# Altium schematic sheet MCU.SchDoc
size A3
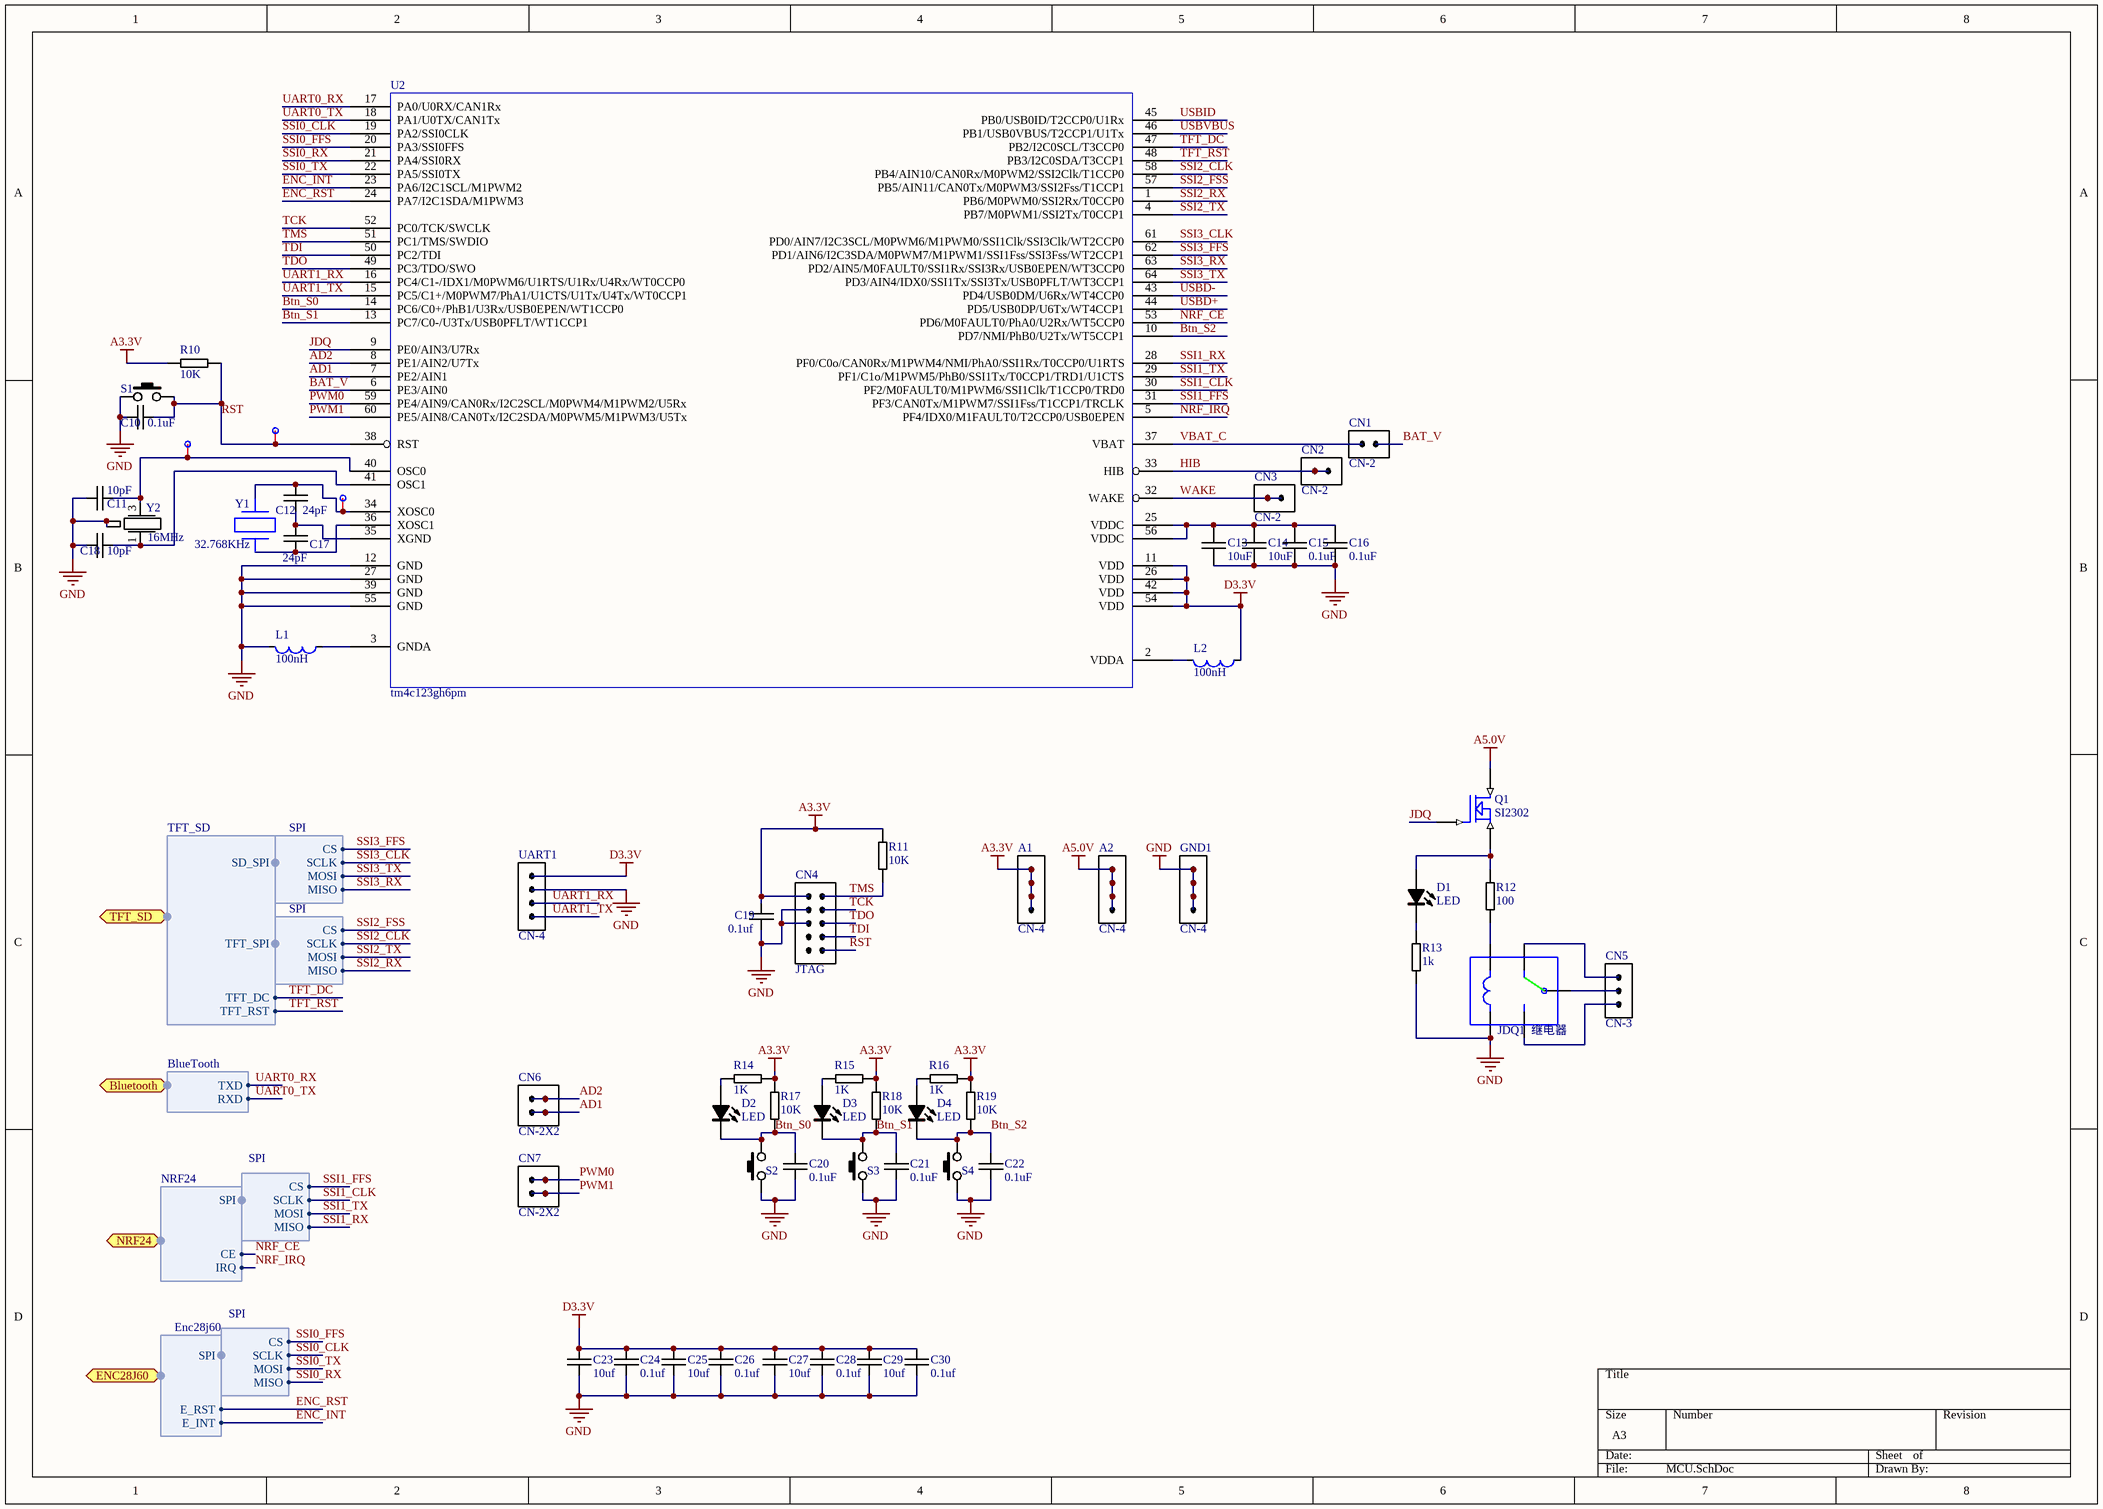
[diagram p0: MCU.SchDoc]

## Parts
*2  Point  [Point]  (value not drawn)
*3  Point  [Point]  (value not drawn)
*4  Point  [Point]  (value not drawn)
A1  CN-4  [SIP-4]
A2  CN-4  [SIP-4]
C10  0.1uF  [0805-C]
C11  10pF  [0805-C]
C12  24pF  [0805-C]
C13  10uF  [0805-C]
C14  10uF  [0805-C]
C15  0.1uF  [0805-C]
C16  0.1uF  [0805-C]
C17  24pF  [0805-C]
C18  10pF  [0805-C]
C19  0.1uf  [0805-C]
C20  0.1uF  [0805-C]
C21  0.1uF  [0805-C]
C22  0.1uF  [0805-C]
C23  10uf  [0603]
C24  0.1uf  [0603]
C25  10uf  [0603]
C26  0.1uf  [0603]
C27  10uf  [0603]
C28  0.1uf  [0603]
C29  10uf  [0603]
C30  0.1uf  [0603]
CN1  CN-2  [SIP-2]
CN2  CN-2  [SIP-2]
CN3  CN-2  [SIP-2]
CN4  JTAG  [IDC-10]
CN5  CN-3  [SIP-3]
CN6  CN-2X2  [IDC-4]
CN7  CN-2X2  [IDC-4]
D1  LED  [0805-LED]
D2  LED  [0805-LED]
D3  LED  [0805-LED]
D4  LED  [0805-LED]
GND1  CN-4  [SIP-4]
JDQ1  继电器  [继电器]
L1  100nH  [0805]
L2  100nH  [0805]
Q1  SI2302  [sot-23]
R10  10K  [0805-R]
R11  10K  [0805-R]
R12  100  [0603]
R13  1k  [0805-R]
R14  1K  [0805-R]
R15  1K  [0805-R]
R16  1K  [0805-R]
R17  10K  [0805-R]
R18  10K  [0805-R]
R19  10K  [0805-R]
S1  KEY(轻触,6×6×4.3)  [轻触开关(3*6*2.5)]  (value not drawn)
S2  KEY(轻触,6×6×4.3)  [轻触开关(3*6*2.5)]  (value not drawn)
S3  KEY(轻触,6×6×4.3)  [轻触开关(3*6*2.5)]  (value not drawn)
S4  KEY(轻触,6×6×4.3)  [轻触开关(3*6*2.5)]  (value not drawn)
U2  tm4c123gh6pm  [LQFP64]
UART1  CN-4  [SIP-4]
Y1  32.768KHz  [XTAL(Φ2×6)]
Y2  16MHz  [4脚晶振]

## Ports
Bluetooth (harness BlueTooth), ENC28J60 (harness Enc28j60), NRF24 (harness NRF24), TFT_SD (harness TFT_SD)

## Harnesses
Enc28j60: SPI, E_RST, E_INT
SPI: CS, SCLK, MOSI, MISO
NRF24: SPI, CE, IRQ
BlueTooth: TXD, RXD
TFT_SD: SD_SPI, TFT_SPI, TFT_DC, TFT_RST

## Nets
A3.3V: A1.1 A1.2 A1.3 A1.4 C19.1 CN4.1 R10.2 R11.2 R14.2 R15.2 R16.2 R17.1 R18.1 R19.1
A5.0V: A2.1 A2.2 A2.3 A2.4 Q1.3(D)
D3.3V: C23.1 C24.1 C25.1 C26.1 C27.1 C28.1 C29.1 C30.1 L2.2 U2.11(VDD) U2.26(VDD) U2.42(VDD) U2.54(VDD) UART1.1
GND: C10.1 C11.1 C13.2 C14.2 C15.2 C16.2 C18.1 C19.2 C20.1 C21.1 C22.1 C23.2 C24.2 C25.2 C26.2 C27.2 C28.2 C29.2 C30.2 CN4.3 CN4.5 GND1.1 GND1.2 GND1.3 GND1.4 JDQ1.5(I2) L1.1 R13.2 S1.1 S2.1 S3.1 S4.1 U2.12(GND) U2.27(GND) U2.39(GND) U2.55(GND) UART1.2 Y2.2(G) Y2.4(G)
AD1: CN6.3 CN6.4 U2.7(PE2/AIN1)
AD2: CN6.1 CN6.2 U2.8(PE1/AIN2/U7Tx)
BAT_V: CN1.2 U2.6(PE3/AIN0)
Btn_S0: C20.2 D2.2(K) R17.2 S2.2 U2.14(PC6/C0+/PhB1/U3Rx/USB0EPEN/WT1CCP0)
Btn_S1: C21.2 D3.2(K) R18.2 S3.2 U2.13(PC7/C0-/U3Tx/USB0PFLT/WT1CCP1)
Btn_S2: C22.2 D4.2(K) R19.2 S4.2 U2.10(PD7/NMI/PhB0/U2Tx/WT5CCP1)
ENC_INT: U2.23(PA6/I2C1SCL/M1PWM2) ; port ENC28J60.E_INT
ENC_RST: U2.24(PA7/I2C1SDA/M1PWM3) ; port ENC28J60.E_RST
HIB: CN2.1 CN2.2 U2.33(HIB)
JDQ: Q1.1(G) U2.9(PE0/AIN3/U7Rx)
NRF_CE: U2.53(PD6/M0FAULT0/PhA0/U2Rx/WT5CCP0) ; port NRF24.CE
NRF_IRQ: U2.5(PF4/IDX0/M1FAULT0/T2CCP0/USB0EPEN) ; port NRF24.IRQ
PWM0: CN7.1 CN7.2 U2.59(PE4/AIN9/CAN0Rx/I2C2SCL/M0PWM4/M1PWM2/U5Rx)
PWM1: CN7.3 CN7.4 U2.60(PE5/AIN8/CAN0Tx/I2C2SDA/M0PWM5/M1PWM3/U5Tx)
RST: *2.1(Point) C10.2 CN4.10 R10.1 S1.2 U2.38(RST)
SSI0_CLK: U2.19(PA2/SSI0CLK) ; harness SPI.SCLK
SSI0_FFS: U2.20(PA3/SSI0FFS) ; harness SPI.CS
SSI0_RX: U2.21(PA4/SSI0RX) ; harness SPI.MISO
SSI0_TX: U2.22(PA5/SSI0TX) ; harness SPI.MOSI
SSI1_CLK: U2.30(PF2/M0FAULT0/M1PWM6/SSI1Clk/T1CCP0/TRD0) ; harness SPI.SCLK
SSI1_FFS: U2.31(PF3/CAN0Tx/M1PWM7/SSI1Fss/T1CCP1/TRCLK) ; harness SPI.CS
SSI1_RX: U2.28(PF0/C0o/CAN0Rx/M1PWM4/NMI/PhA0/SSI1Rx/T0CCP0/U1RTS) ; harness SPI.MISO
SSI1_TX: U2.29(PF1/C1o/M1PWM5/PhB0/SSI1Tx/T0CCP1/TRD1/U1CTS) ; harness SPI.MOSI
SSI2_CLK: U2.58(PB4/AIN10/CAN0Rx/M0PWM2/SSI2Clk/T1CCP0) ; harness SPI.SCLK
SSI2_FSS: U2.57(PB5/AIN11/CAN0Tx/M0PWM3/SSI2Fss/T1CCP1) ; harness SPI.CS
SSI2_RX: U2.1(PB6/M0PWM0/SSI2Rx/T0CCP0) ; harness SPI.MISO
SSI2_TX: U2.4(PB7/M0PWM1/SSI2Tx/T0CCP1) ; harness SPI.MOSI
SSI3_CLK: U2.61(PD0/AIN7/I2C3SCL/M0PWM6/M1PWM0/SSI1Clk/SSI3Clk/WT2CCP0) ; harness SPI.SCLK
SSI3_FFS: U2.62(PD1/AIN6/I2C3SDA/M0PWM7/M1PWM1/SSI1Fss/SSI3Fss/WT2CCP1) ; harness SPI.CS
SSI3_RX: U2.63(PD2/AIN5/M0FAULT0/SSI1Rx/SSI3Rx/USB0EPEN/WT3CCP0) ; harness SPI.MISO
SSI3_TX: U2.64(PD3/AIN4/IDX0/SSI1Tx/SSI3Tx/USB0PFLT/WT3CCP1) ; harness SPI.MOSI
TCK: CN4.4 U2.52(PC0/TCK/SWCLK)
TDI: CN4.8 U2.50(PC2/TDI)
TDO: CN4.6 U2.49(PC3/TDO/SWO)
TFT_DC: U2.47(PB2/I2C0SCL/T3CCP0) ; port TFT_SD.TFT_DC
TFT_RST: U2.48(PB3/I2C0SDA/T3CCP1) ; port TFT_SD.TFT_RST
TMS: CN4.2 R11.1 U2.51(PC1/TMS/SWDIO)
UART0_RX: U2.17(PA0/U0RX/CAN1Rx) ; port Bluetooth.TXD
UART0_TX: U2.18(PA1/U0TX/CAN1Tx) ; port Bluetooth.RXD
UART1_RX: U2.16(PC4/C1-/IDX1/M0PWM6/U1RTS/U1Rx/U4Rx/WT0CCP0) UART1.3
UART1_TX: U2.15(PC5/C1+/M0PWM7/PhA1/U1CTS/U1Tx/U4Tx/WT0CCP1) UART1.4
USBD+: U2.44(PD5/USB0DP/U6Tx/WT4CCP1)
USBD-: U2.43(PD4/USB0DM/U6Rx/WT4CCP0)
USBID: U2.45(PB0/USB0ID/T2CCP0/U1Rx)
USBVBUS: U2.46(PB1/USB0VBUS/T2CCP1/U1Tx)
VBAT_C: CN1.1 U2.37(VBAT)
WAKE: CN3.1 CN3.2 U2.32(WAKE)
Net*3_1: *3.1(Point) C11.2 U2.40(OSC0) Y2.3(O)
Net*4_1: *4.1(Point) C12.1 U2.34(XOSC0) Y1.1
NetC12_2: C12.2 C17.1 U2.35(XGND)
NetC13_1: C13.1 C14.1 C15.1 C16.1 U2.25(VDDC) U2.56(VDDC)
NetC17_2: C17.2 U2.36(XOSC1) Y1.2
NetC18_2: C18.2 U2.41(OSC1) Y2.1(O)
NetCN5_1: CN5.1 JDQ1.4
NetCN5_2: CN5.2 JDQ1.1
NetCN5_3: CN5.3 JDQ1.3
NetD1_1: D1.1(A) Q1.2(S) R12.1
NetD1_2: D1.2(K) R13.1
NetD2_1: D2.1(A) R14.1
NetD3_1: D3.1(A) R15.1
NetD4_1: D4.1(A) R16.1
NetJDQ1_2: JDQ1.2(I1) R12.2
NetL1_2: L1.2 U2.3(GNDA)
NetL2_1: L2.1 U2.2(VDDA)

Not connected (* = marked no-connect by the designer): CN4 7 9

## Library data of the parts
C10-C30 = CAP_Chip: 贴片
CN4 = CN-5X2
D1-D4 = LED: 贴片
L1 L2 = L
R10-R19 = RES_Chip: 贴片
S1-S4 = KEY(轻触,6×6×4.3): 1.09.02.0001
Y1 = XTAL_32_768
Y2 = XTAL_16M